# EAGLE schematic voltage_conditioner (EAGLE 7.6.0)
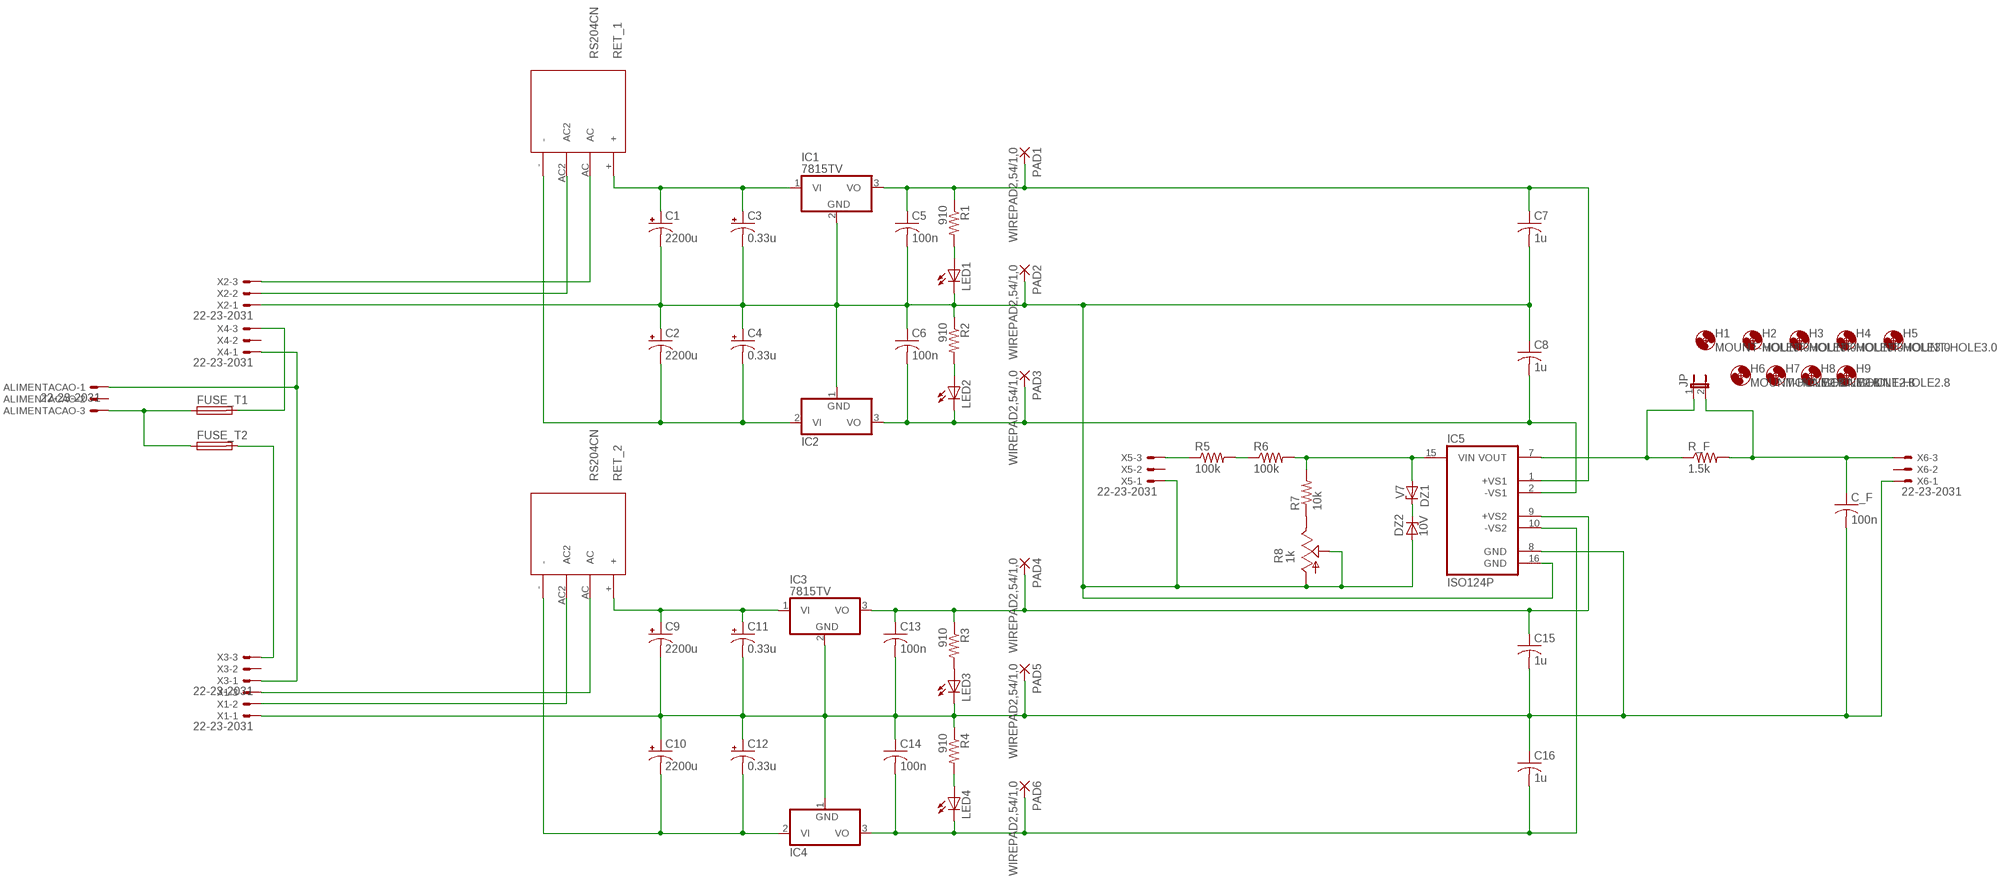
[diagram p0: schematic, sheet 1]

## Parts
ALIMENTACAO  22-23-2031  [22-23-2031]
C1  2200u  CPOL-USE5-10.5  [E5-10,5]
C2  2200u  CPOL-USE5-10.5  [E5-10,5]
C3  0.33u  CPOL-USE2.5-5  [E2,5-5]
C4  0.33u  CPOL-USE2.5-5  [E2,5-5]
C5  100n  C-US050-025X075  [C050-025X075]
C6  100n  C-US050-025X075  [C050-025X075]
C7  1u  C-US025-025X050  [C025-025X050]
C8  1u  C-US025-025X050  [C025-025X050]
C9  2200u  CPOL-USE5-10.5  [E5-10,5]
C10  2200u  CPOL-USE5-10.5  [E5-10,5]
C11  0.33u  CPOL-USE2.5-5  [E2,5-5]
C12  0.33u  CPOL-USE2.5-5  [E2,5-5]
C13  100n  C-US050-025X075  [C050-025X075]
C14  100n  C-US050-025X075  [C050-025X075]
C15  1u  C-US025-025X050  [C025-025X050]
C16  1u  C-US025-025X050  [C025-025X050]
C_F  100n  C-US050-025X075  [C050-025X075]
DZ1  V7  ZENER-DIODEDO35Z10  [DO35Z10]
DZ2  10V  ZENER-DIODEDO35Z10  [DO35Z10]
FUSE_T1  GSH15  [GSH15]
FUSE_T2  GSH15  [GSH15]
H1  MOUNT-HOLE3.0  [3,0]
H2  MOUNT-HOLE3.0  [3,0]
H3  MOUNT-HOLE3.0  [3,0]
H4  MOUNT-HOLE3.0  [3,0]
H5  MOUNT-HOLE3.0  [3,0]
H6  MOUNT-HOLE2.8  [2,8]
H7  MOUNT-HOLE2.8  [2,8]
H8  MOUNT-HOLE2.8  [2,8]
H9  MOUNT-HOLE2.8  [2,8]
IC1  7815TV  [TO220V]
IC2  7915C  [TO220V]
IC3  7815TV  [TO220V]
IC4  7915C  [TO220V]
IC5  ISO124P  [DIL16/8]
JP  JP1E  [JP1]
LED1  LED3MM  [LED3MM]
LED2  LED3MM  [LED3MM]
LED3  LED3MM  [LED3MM]
LED4  LED3MM  [LED3MM]
PAD1  WIREPAD2,54/1,0  [2,54/1,0]
PAD2  WIREPAD2,54/1,0  [2,54/1,0]
PAD3  WIREPAD2,54/1,0  [2,54/1,0]
PAD4  WIREPAD2,54/1,0  [2,54/1,0]
PAD5  WIREPAD2,54/1,0  [2,54/1,0]
PAD6  WIREPAD2,54/1,0  [2,54/1,0]
R1  910  R-US_0207/7  [0207/7]
R2  910  R-US_0207/7  [0207/7]
R3  910  R-US_0207/7  [0207/7]
R4  910  R-US_0207/7  [0207/7]
R5  100k  R-US_0204/7  [0204/7]
R6  100k  R-US_0204/7  [0204/7]
R7  10k  R-US_0204/7  [0204/7]
R8  1k  TRIM_US-RS3  [RS3]
R_F  1.5k  R-US_0204/7  [0204/7]
RET_1  RS204CN  [SIP]
RET_2  RS204CN  [SIP]
X1  22-23-2031  [22-23-2031]
X2  22-23-2031  [22-23-2031]
X3  22-23-2031  [22-23-2031]
X4  22-23-2031  [22-23-2031]
X5  22-23-2031  [22-23-2031]
X6  22-23-2031  [22-23-2031]

## Nets
GND_ENTRADA: C1.- C2.+ C3.- C4.+ C5.2 C6.1 C7.2 C8.1 DZ2.A IC1.2(GND) IC2.1(GND) IC5.16(GND) LED1.K(C) PAD2.1(P) R2.1 R8.A R8.S X2.1 X5.1
GND_SAIDA: C9.- C10.+ C11.- C12.+ C13.2 C14.1 C15.2 C16.1 C_F.2 IC3.2(GND) IC4.1(GND) IC5.8(GND) LED3.K(C) PAD5.1(P) R4.1 X1.1 X6.1
N$1: IC5.7(VOUT) JP.1 R_F.1
N$2: FUSE_T2.2 X3.3
N$3: ALIMENTACAO.3 FUSE_T1.1 FUSE_T2.1
N$4: FUSE_T1.2 X4.3
N$5: RET_1.AC X2.3
N$6: RET_2.AC X1.3
N$8: C1.+ C3.+ IC1.1(VI) RET_1.+
N$9: C13.1 C15.1 IC3.3(VO) IC5.9(+VS2) PAD4.1(P) R3.1
N$10: C2.- C4.- IC2.2(VI) RET_1.-
N$11: RET_2.AC2 X1.2
N$12: R5.1 X5.3
N$13: C9.+ C11.+ IC3.1(VI) RET_2.+
N$14: R7.1 R8.E
N$15: C5.1 C7.1 IC1.3(VO) IC5.1(+VS1) PAD1.1(P) R1.1
N$16: C10.- C12.- IC4.2(VI) RET_2.-
N$17: RET_1.AC2 X2.2
N$18: C14.2 C16.2 IC4.3(VO) IC5.10(-VS2) LED4.K(C) PAD6.1(P)
N$19: R5.2 R6.1
N$20: DZ1.A IC5.15(VIN) R6.2 R7.2
N$21: LED2.A R2.2
N$22: ALIMENTACAO.1 X3.1 X4.1
N$23: C_F.1 JP.2 R_F.2 X6.3
N$24: DZ1.C DZ2.C
N$28: LED1.A R1.2
N$33: LED3.A R3.2
N$34: LED4.A R4.2
Z2: C6.2 C8.2 IC2.3(VO) IC5.2(-VS1) LED2.K(C) PAD3.1(P)
Unconnected: ALIMENTACAO.2 X3.2 X4.2 X5.2 X6.2

## Library data of the parts
ALIMENTACAO X1-X6 = con-molex:22-23-2031: .100" (2.54mm) Center Header - 3 Pin; MF: MOLEX; MPN: 22-23-2031; OC_FARNELL: 1462950; OC_NEWARK: 30C0862
C1-C4 C9-C12 = rcl:CPOL-US: POLARIZED CAPACITOR, American symbol
C5-C8 C13-C16 C_F = rcl:C-US: CAPACITOR, American symbol
DZ1 DZ2 = diode:ZENER-DIODE: Z-Diode
FUSE_T1 FUSE_T2 = fuse:GSH15: FUSE HOLDER grid 15mm, 19649 Wickmann; MPN: 64900001039; OC_FARNELL: 1271673; OC_NEWARK: 02P0318
H1-H9 = holes:MOUNT-HOLE: MOUNTING HOLE with drill center marker
IC1 IC3 = linear:78*: Positive VOLTAGE REGULATOR Source: http://cache.national.com/ds/LM/LM78L05.pdf http://www.fairchildsemi.com/ds/LM/LM7805.pdf
IC2 IC4 = linear:79*: Negative VOLTAGE REGULATOR
IC5 = burr-brown:ISO124: Isolation Amplifier Precision, Lowest Cost; MF: TEXAS INSTRUMENTS; MPN: ISO124P; OC_FARNELL: 1212425; OC_NEWARK: 35C1752
JP = jumper:JP1E: JUMPER
LED1 = adafruit:LED: LED
LED2-LED4 = led:LED: LED
PAD1-PAD6 = wirepad:WIREPAD: Wire PAD connect wire on PCB
R1-R7 R_F = rcl:R-US_: RESISTOR, American symbol
R8 = pot:TRIM_US-: POTENTIOMETER
RET_1 RET_2 = minha-lib:RS204